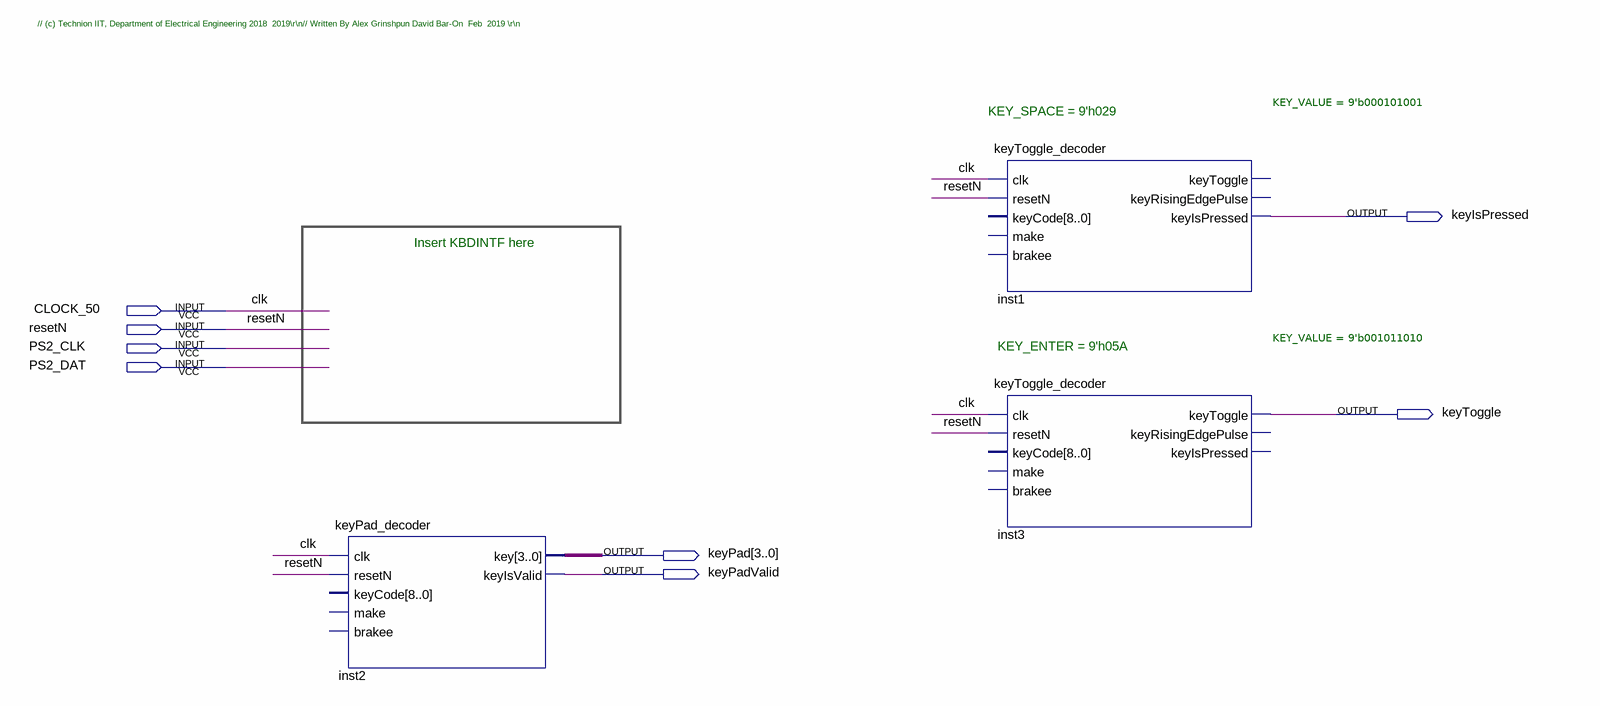
[diagram p0: schematic sheet]
// Quartus schematic TOP_KBD_DEMOALL.bdf as structural Verilog: 3 symbols, 8 pins
module TOP_KBD_DEMOALL (
  input  CLOCK_50,
  input  resetN,
  input  PS2_CLK,
  input  PS2_DAT,
  output keyIsPressed,
  output keyToggle,
  output [3:0] keyPad,
  output keyPadValid
);

  keyPad_decoder inst2 (
    .clk(CLOCK_50), .resetN(resetN), .key(keyPad), .keyIsValid(keyPadValid));  // open: keyCode, make, brakee
  keyToggle_decoder #(.KEY_VALUE(9'b000101001)) inst1 (
    .clk(CLOCK_50), .resetN(resetN), .keyIsPressed(keyIsPressed));  // open: keyCode, make, brakee, keyToggle, keyRisingEdgePulse
  keyToggle_decoder #(.KEY_VALUE(9'b001011010)) inst3 (
    .clk(CLOCK_50), .resetN(resetN), .keyToggle(keyToggle));  // open: keyCode, make, brakee, keyRisingEdgePulse, keyIsPressed

  // Other names for the same wires on the sheet: clk = CLOCK_50

  // Notes on the sheet:
  //   // (c) Technion IIT, Department of Electrical Engineering 2018  2019\r\n// Written By Alex Grinshpun David Bar-On  Feb  2019 \r\n
  //   KEY_SPACE = 9'h029
  //   Insert KBDINTF here
  //   KEY_ENTER = 9'h05A
endmodule
